# Altium schematic sheet 语音.SchDoc
size A3
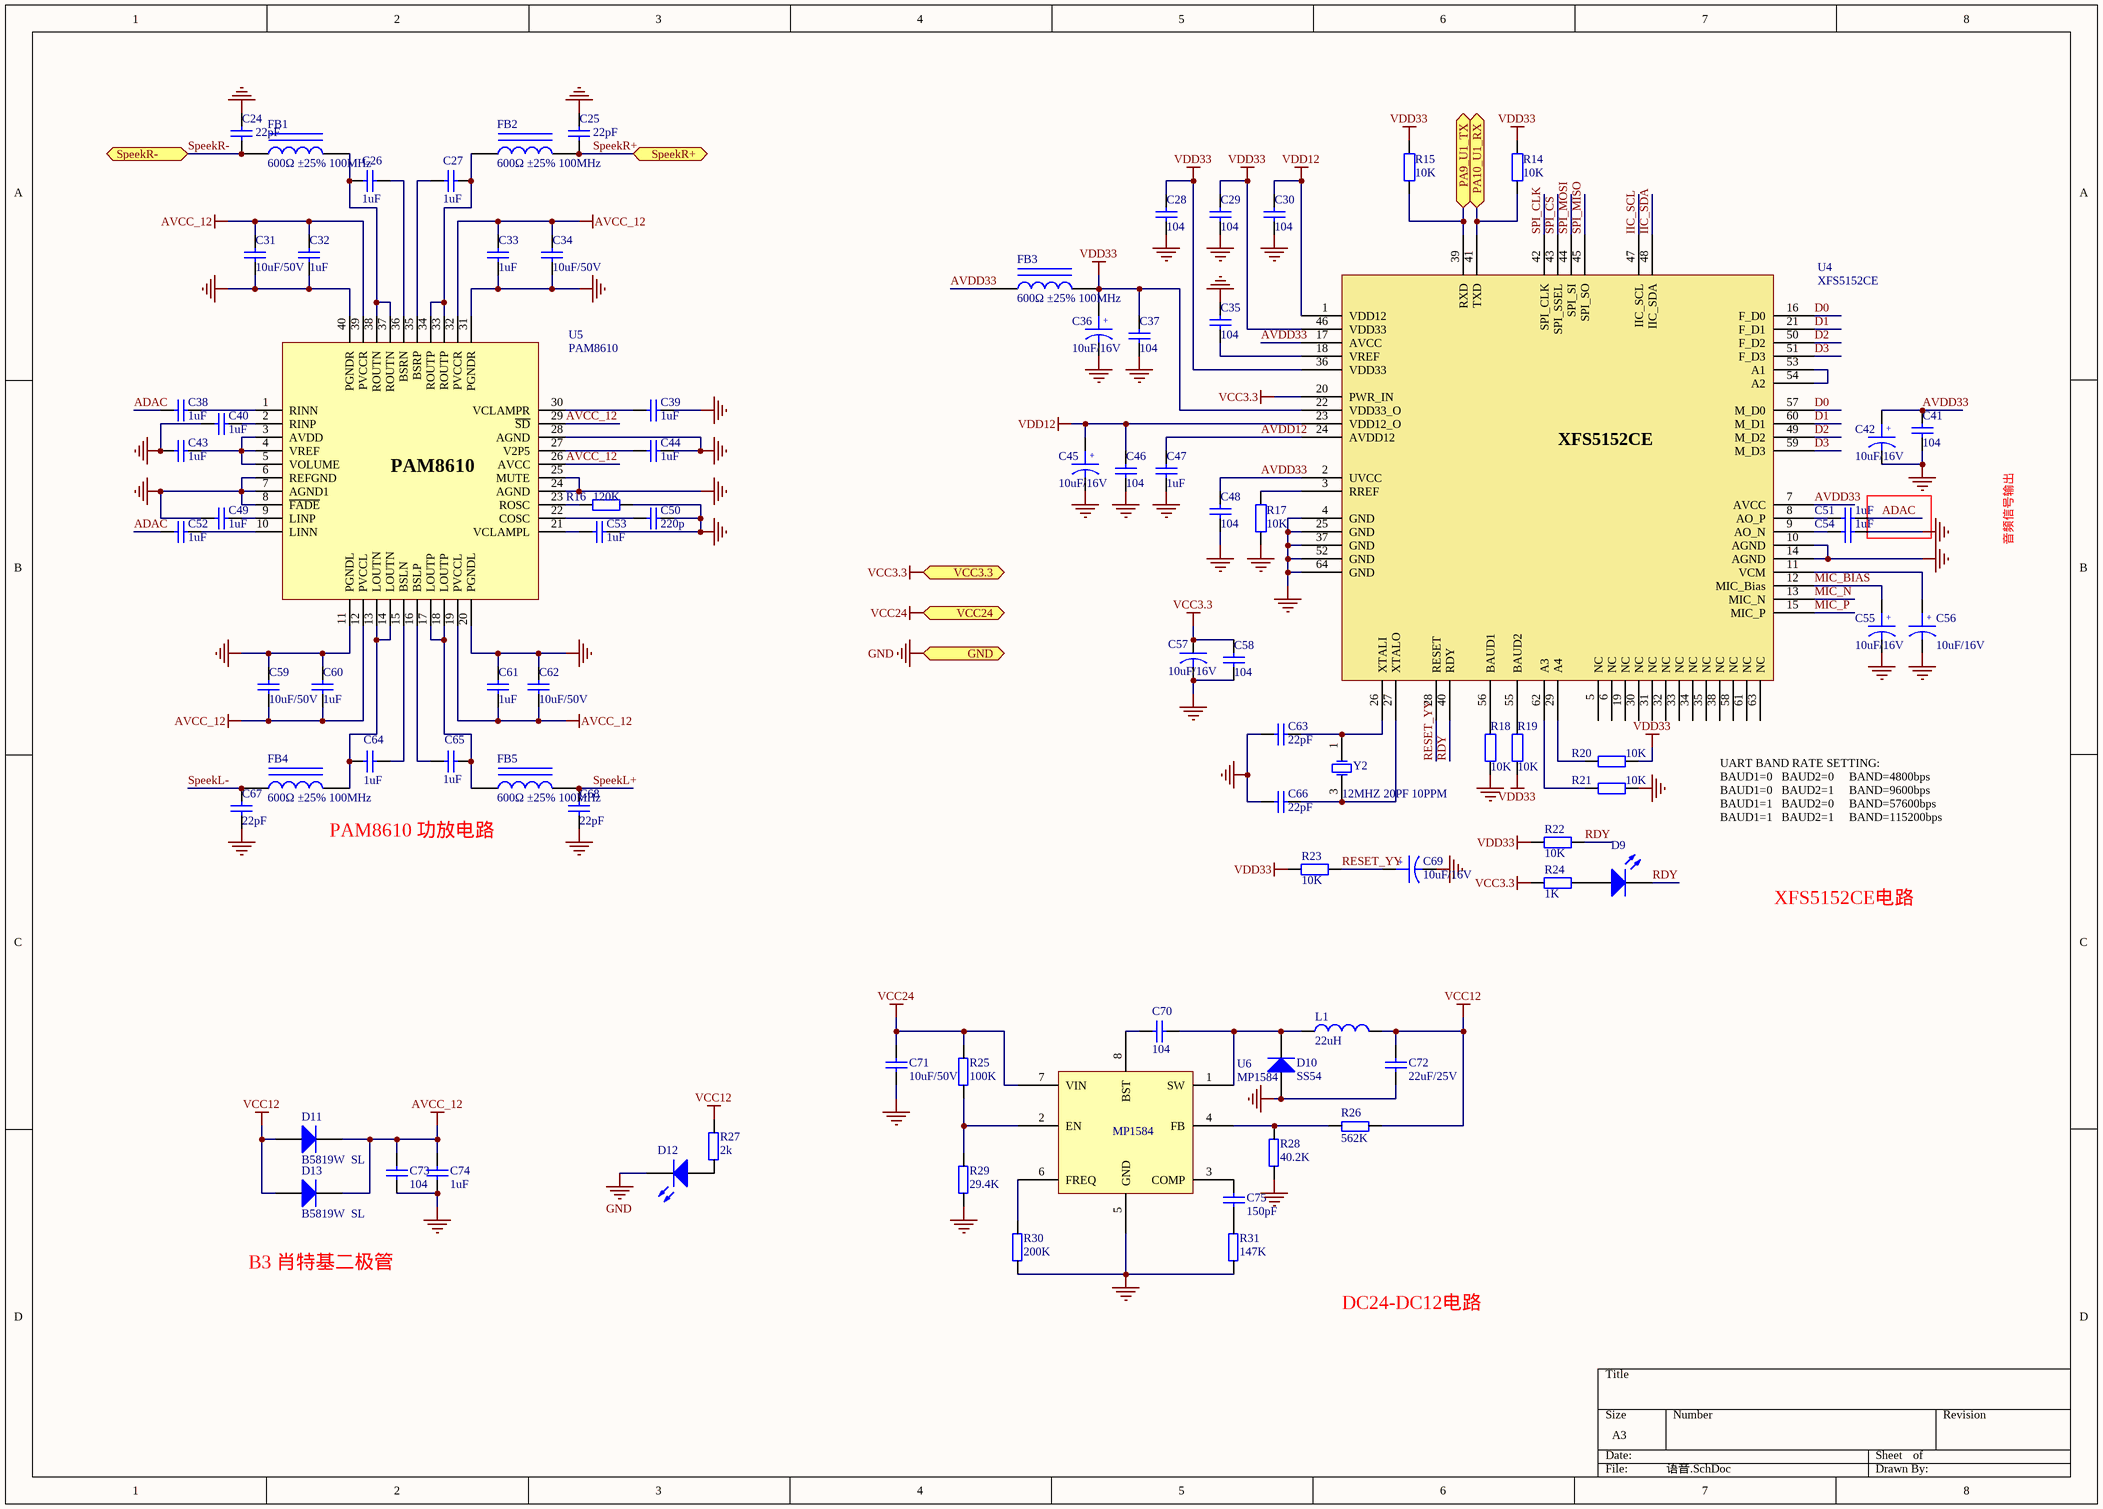
[diagram p0: 语音.SchDoc]

## Parts
C24  22pF  [0603_C]
C25  22pF  [0603_C]
C26  1uF  [0603_C]
C27  1uF  [0603_C]
C28  104  [0603_C]
C29  104  [0603_C]
C30  104  [0603_C]
C31  10uF/50V  [1206_C]
C32  1uF  [0603_C]
C33  1uF  [0603_C]
C34  10uF/50V  [1206_C]
C35  104  [0603_C]
C36  10uF/16V  [3216]
C37  104  [0603_C]
C38  1uF  [0603_C]
C39  1uF  [0603_C]
C40  1uF  [0603_C]
C41  104  [0603_C]
C42  10uF/16V  [3216]
C43  1uF  [0603_C]
C44  1uF  [0603_C]
C45  10uF/16V  [3216]
C46  104  [0603_C]
C47  1uF  [0603_C]
C48  104  [0603_C]
C49  1uF  [0603_C]
C50  220p  [0603_C]
C51  1uF  [0603_C]
C52  1uF  [0603_C]
C53  1uF  [0603_C]
C54  1uF  [0603_C]
C55  10uF/16V  [3216]
C56  10uF/16V  [3216]
C57  10uF/16V  [3216]
C58  104  [0603_C]
C59  10uF/50V  [1206_C]
C60  1uF  [0603_C]
C61  1uF  [0603_C]
C62  10uF/50V  [1206_C]
C63  22pF  [0603_C]
C64  1uF  [0603_C]
C65  1uF  [0603_C]
C66  22pF  [0603_C]
C67  22pF  [0603_C]
C68  22pF  [0603_C]
C69  10uF/16V  [3216]
C70  104  [0603_C]
C71  10uF/50V  [1206_C]
C72  22uF/25V  [0805_C]
C73  104  [0603_C]
C74  1uF  [0603_C]
C75  150pF  [0603_C]
D9  红灯 0805  [LC-0805_LED_S1]  (value not drawn)
D10  SS54  [SMA(DO-214AC)_S1]
D11  B5819W  SL  [SOD-123]
D12  蓝灯 0805  [LC-0805_LED_S1]  (value not drawn)
D13  B5819W  SL  [SOD-123]
FB1  600Ω ±25% 100MHz  [0805_L]
FB2  600Ω ±25% 100MHz  [0805_L]
FB3  600Ω ±25% 100MHz  [0805_L]
FB4  600Ω ±25% 100MHz  [0805_L]
FB5  600Ω ±25% 100MHz  [0805_L]
L1  22uH  [L-7*7*4mm-S]
R14  10K  [0603_R]
R15  10K  [0603_R]
R16  120K  [0603_R]
R17  10K  [0603_R]
R18  10K  [0603_R]
R19  10K  [0603_R]
R20  10K  [0603_R]
R21  10K  [0603_R]
R22  10K  [0603_R]
R23  10K  [0603_R]
R24  1K  [0603_R]
R25  100K  [0603_R]
R26  562K  [0603_R]
R27  2k  [0603_R]
R28  40.2K  [0603_R]
R29  29.4K  [0603_R]
R30  200K  [0603_R]
R31  147K  [0603_R]
U4  XFS5152CE  [LQFP-64_10x10x05P]
U5  PAM8610  [QFN50P600X600X80-40N]
U6  MP1584  [LC-SOIC-8_EP_150MIL]
Y2  12MHZ 20PF 10PPM  [SMD-3225_4P]

## Ports
GND, PA9_U1_TX, PA10_U1_RX, SpeekR+, SpeekR-, VCC3.3, VCC24

## Nets
AVCC_12: C31.1 C32.1 C33.1 C34.1 C59.1 C60.1 C61.1 C62.1 C73.1 C74.1 D11.2(K) D13.2(K) U5.12(PVCCL) U5.19(PVCCL) U5.26(AVCC) U5.29(~{SD}) U5.32(PVCCR) U5.39(PVCCR)
GND: C24.1 C25.1 C28.2 C29.2 C30.2 C31.2 C32.2 C33.2 C34.2 C35.1 C36.2 C37.2 C39.2 C40.1 C41.2 C42.2 C43.1 C44.2 C45.2 C46.2 C47.1 C48.2 C49.1 C50.2 C53.2 C54.1 C55.2 C56.2 C57.2 C58.2 C59.2 C60.2 C61.2 C62.2 C63.1 C66.1 C67.1 C68.1 C69.2 C71.2 C72.1 C73.2 C74.2 D10.1(A) D12.K R16.1 R17.1 R18.2 R21.1 R28.2 R29.2 R30.2 R31.2 U4.4(GND) U4.10(AGND) U4.14(AGND) U4.25(GND) U4.37(GND) U4.52(GND) U4.64(GND) U5.6(REFGND) U5.7(AGND1) U5.8(~{FADE}) U5.11(PGNDL) U5.20(PGNDL) U5.24(AGND) U5.25(MUTE) U5.28(AGND) U5.31(PGNDR) U5.40(PGNDR) U6.5(GND) ; port GND
VCC3.3: C57.1 C58.1 R24.1 U4.20(PWR_IN) ; port VCC3.3
VCC12: C72.2 D11.1(A) D13.1(A) L1.2 R26.2 R27.1
VCC24: C71.1 R25.1 U6.7(VIN) ; port VCC24
VDD12: C30.1 C45.1 C46.1 U4.1(VDD12) U4.23(VDD12_O)
VDD33: C28.1 C29.1 C36.1 C37.1 FB3.2 R14.2 R15.1 R19.2 R20.2 R22.1 R23.1 U4.22(VDD33_O) U4.36(VDD33) U4.46(VDD33)
ADAC: C38.1 C51.1 C52.1
AVDD12: C47.2 U4.24(AVDD12)
AVDD33: C41.1 C42.1 C48.1 FB3.1 U4.2(UVCC) U4.7(AVCC) U4.17(AVCC)
D0: U4.16(F_D0) U4.57(M_D0)
D1: U4.21(F_D1) U4.60(M_D1)
D2: U4.49(M_D2) U4.50(F_D2)
D3: U4.51(F_D3) U4.59(M_D3)
IIC_SCL: U4.47(IIC_SCL)
IIC_SDA: U4.48(IIC_SDA)
MIC_BIAS: C55.1 U4.12(MIC_Bias)
MIC_N: U4.13(MIC_N)
MIC_P: U4.15(MIC_P)
PA9_U1_TX: R15.2 U4.39(RXD) ; port PA9_U1_TX
PA10_U1_RX: R14.1 U4.41(TXD) ; port PA10_U1_RX
RDY: D9.K R22.2 U4.40(RDY)
RESET_YY: C69.1 R23.2 U4.28(RESET)
SpeekL+: C68.2 FB5.2
SpeekL-: C67.2 FB4.1
SpeekR+: C25.2 FB2.2 ; port SpeekR+
SpeekR-: C24.2 FB1.1 ; port SpeekR-
SPI_CLK: U4.42(SPI_CLK)
SPI_CS: U4.43(SPI_SSEL)
SPI_MISO: U4.45(SPI_SO)
SPI_MOSI: U4.44(SPI_SI)
NetC26_1: C26.1 FB1.2 U5.37(ROUTN) U5.38(ROUTN)
NetC26_2: C26.2 U5.36(BSRN)
NetC27_1: C27.1 U5.35(BSRP)
NetC27_2: C27.2 FB2.1 U5.33(ROUTP) U5.34(ROUTP)
NetC35_2: C35.2 U4.18(VREF)
NetC38_2: C38.2 U5.1(RINN)
NetC39_1: C39.1 U5.30(VCLAMPR)
NetC40_2: C40.2 U5.2(RINP)
NetC43_2: C43.2 U5.3(AVDD) U5.4(VREF) U5.5(VOLUME)
NetC44_1: C44.1 U5.27(V2P5)
NetC49_2: C49.2 U5.9(LINP)
NetC50_1: C50.1 U5.22(COSC)
NetC51_2: C51.2 U4.8(AO_P)
NetC52_2: C52.2 U5.10(LINN)
NetC53_1: C53.1 U5.21(VCLAMPL)
NetC54_2: C54.2 U4.9(AO_N)
NetC56_1: C56.1 U4.11(VCM)
NetC63_2: C63.2 U4.26(XTALI) Y2.1(OSC1)
NetC64_1: C64.1 U5.15(BSLN)
NetC64_2: C64.2 FB4.2 U5.13(LOUTN) U5.14(LOUTN)
NetC65_1: C65.1 U5.16(BSLP)
NetC65_2: C65.2 FB5.1 U5.17(LOUTP) U5.18(LOUTP)
NetC66_2: C66.2 U4.27(XTALO) Y2.3(OSC2)
NetC70_1: C70.1 D10.2(K) L1.1 U6.1(SW)
NetC70_2: C70.2 U6.8(BST)
NetC75_1: C75.1 R31.1
NetC75_2: C75.2 U6.3(COMP)
NetD9_A: D9.A R24.2
NetD12_A: D12.A R27.2
NetR16_2: R16.2 U5.23(ROSC)
NetR17_2: R17.2 U4.3(RREF)
NetR18_1: R18.1 U4.56(BAUD1)
NetR19_1: R19.1 U4.55(BAUD2)
NetR20_1: R20.1 U4.29(A4)
NetR21_2: R21.2 U4.62(A3)
NetR25_2: R25.2 R29.1 U6.2(EN)
NetR26_1: R26.1 R28.1 U6.4(FB)
NetR30_1: R30.1 U6.6(FREQ)
NetU4_53: U4.53(A1) U4.54(A2)

Not connected (* = marked no-connect by the designer): U4 5(NC) 6(NC) 19(NC) 30(NC) 31(NC) 32(NC) 33(NC) 34(NC) 35(NC) 38(NC) 58(NC) 61(NC) 63(NC)

## Notes on the sheet
- 音频信号输出
- (near FB4) PAM8610 功放电路
- UART BAND RATE SETTING:
  BAUD1=0   BAUD2=0     BAND=4800bps
  BAUD1=0   BAUD2=1     BAND=9600bps
  BAUD1=1   BAUD2=0     BAND=57600bps
  BAUD1=1   BAUD2=1     BAND=115200bps
- XFS5152CE电路
- B3 肖特基二极管
- DC24-DC12电路
- (in symbol CAP POL) +

## Library data of the parts
C24 C67 C68 = Cap Semi: Capacitor (Semiconductor SIM Model); Value: 22p; Published: 8-Jun-2000; LatestRevisionDate: 29-May-2009; LatestRevisionNote: IPC-7351 Footprint Added.; PackageReference: C1206; Publisher: Altium Limited; PackageDescription: Chip Capacitor
C25 C28-C30 C35 C37 C41 C46 C48 C58 C70 C71 C73 C75 = Cap Semi: Capacitor (Semiconductor SIM Model); Published: 8-Jun-2000; LatestRevisionDate: 29-May-2009; LatestRevisionNote: IPC-7351 Footprint Added.; PackageReference: C1206; Publisher: Altium Limited; PackageDescription: Chip Capacitor
  C25: Value: 22pF
  C28-C30 C35 C37 C41 C46 C48 C58 C70 C73: Value: 104
  C71: Value: 10uF/50V
  C75: Value: 150pF
C26 C27 C32 C33 C38-C40 C43 C44 C47 C49-C54 C60 C61 C64 C65 C74 = Cap Semi: Capacitor (Semiconductor SIM Model); Value: 105; Published: 8-Jun-2000; LatestRevisionDate: 29-May-2009; LatestRevisionNote: IPC-7351 Footprint Added.; PackageReference: C1206; Publisher: Altium Limited; PackageDescription: Chip Capacitor
C31 C34 C59 C62 C63 C66 = Cap NP: 电容; Published: 8-Jun-2000; LatestRevisionDate: 17-Jul-2002; LatestRevisionNote: Re-released for DXP Platform.; Publisher: Altium Limited
C36 C42 C45 C55 C56 C69 = CAP POL: Part package: 6032
C57 = CAPACITOR
C72 = Cap Semi: Capacitor (Semiconductor SIM Model); Value: 22uF/16V; Published: 8-Jun-2000; LatestRevisionDate: 29-May-2009; LatestRevisionNote: IPC-7351 Footprint Added.; PackageReference: C1206; Publisher: Altium Limited; PackageDescription: Chip Capacitor
D9 D12 = LED0: Typical INFRARED GaAs LED; Published: 8-Jun-2000; LatestRevisionDate: 08-Jul-2005; LatestRevisionNote: Mech Layer 1 removed.; PackageReference: LED-0; Publisher: Altium Limited; PackageDescription: LED; 2 Leads
D10 = SMA(DO-214AC) SS54: 二极管; ComponentLink1Description: 供应商链接; ComponentLink1URL: http://www.szlcsc.com/product/details_23178.html; Package: SMA(DO-214AC); Supplier: LC; SuppliersPartNumber: C22452
D11 D13 = SOD-123 B5819W  SL: 肖特基二极管; ComponentLink1Description: 供应商链接; ComponentLink1URL: http://www.szlcsc.com/product/details_9093.html; Package: SOD-123; Supplier: LC; SuppliersPartNumber: C8598
FB1-FB5 = 0805 600Ω 25% 100MHz: 贴片磁珠; ComponentLink1Description: 供应商链接; ComponentLink1URL: http://www.szlcsc.com/product/details_1369.html; Package: 0805; Supplier: LC; SuppliersPartNumber: C1017
L1 = Inductor: Code_IEC: 1005; Published: 8-Jun-2000; LatestRevisionDate: 29-May-2009; LatestRevisionNote: IPC-7351 Footprint Added.; PackageReference: 0402-A; Publisher: Altium Limited; PackageDescription: Chip Inductor; Code_JEITA: 0402; Value: 22uH
R14-R24 = Res2: Resistor; Published: 8-Jun-2000; LatestRevisionDate: 17-Jul-2002; LatestRevisionNote: Re-released for DXP Platform.; Publisher: Altium Limited
  R17: PackageReference: AXIAL-0.4; Value: 10K
  R24: PackageReference: AXIAL-0.4; Value: 1K
R25-R31 = R_2
U4 = XFS5152-2
U5 = PAM8610功放芯片
U6 = MP1584EN
Y2 = SMD-3225_4P  12MHZ 20PF 10PPM: 贴片晶振; ComponentLink1Description: 供应商链接; ComponentLink1URL: http://www.szlcsc.com/product/details_9522.html; Package: SMD-3225_4P; Supplier: LC; SuppliersPartNumber: C9002